# EAGLE schematic mosfet_out_cypress (EAGLE 7.2.0)
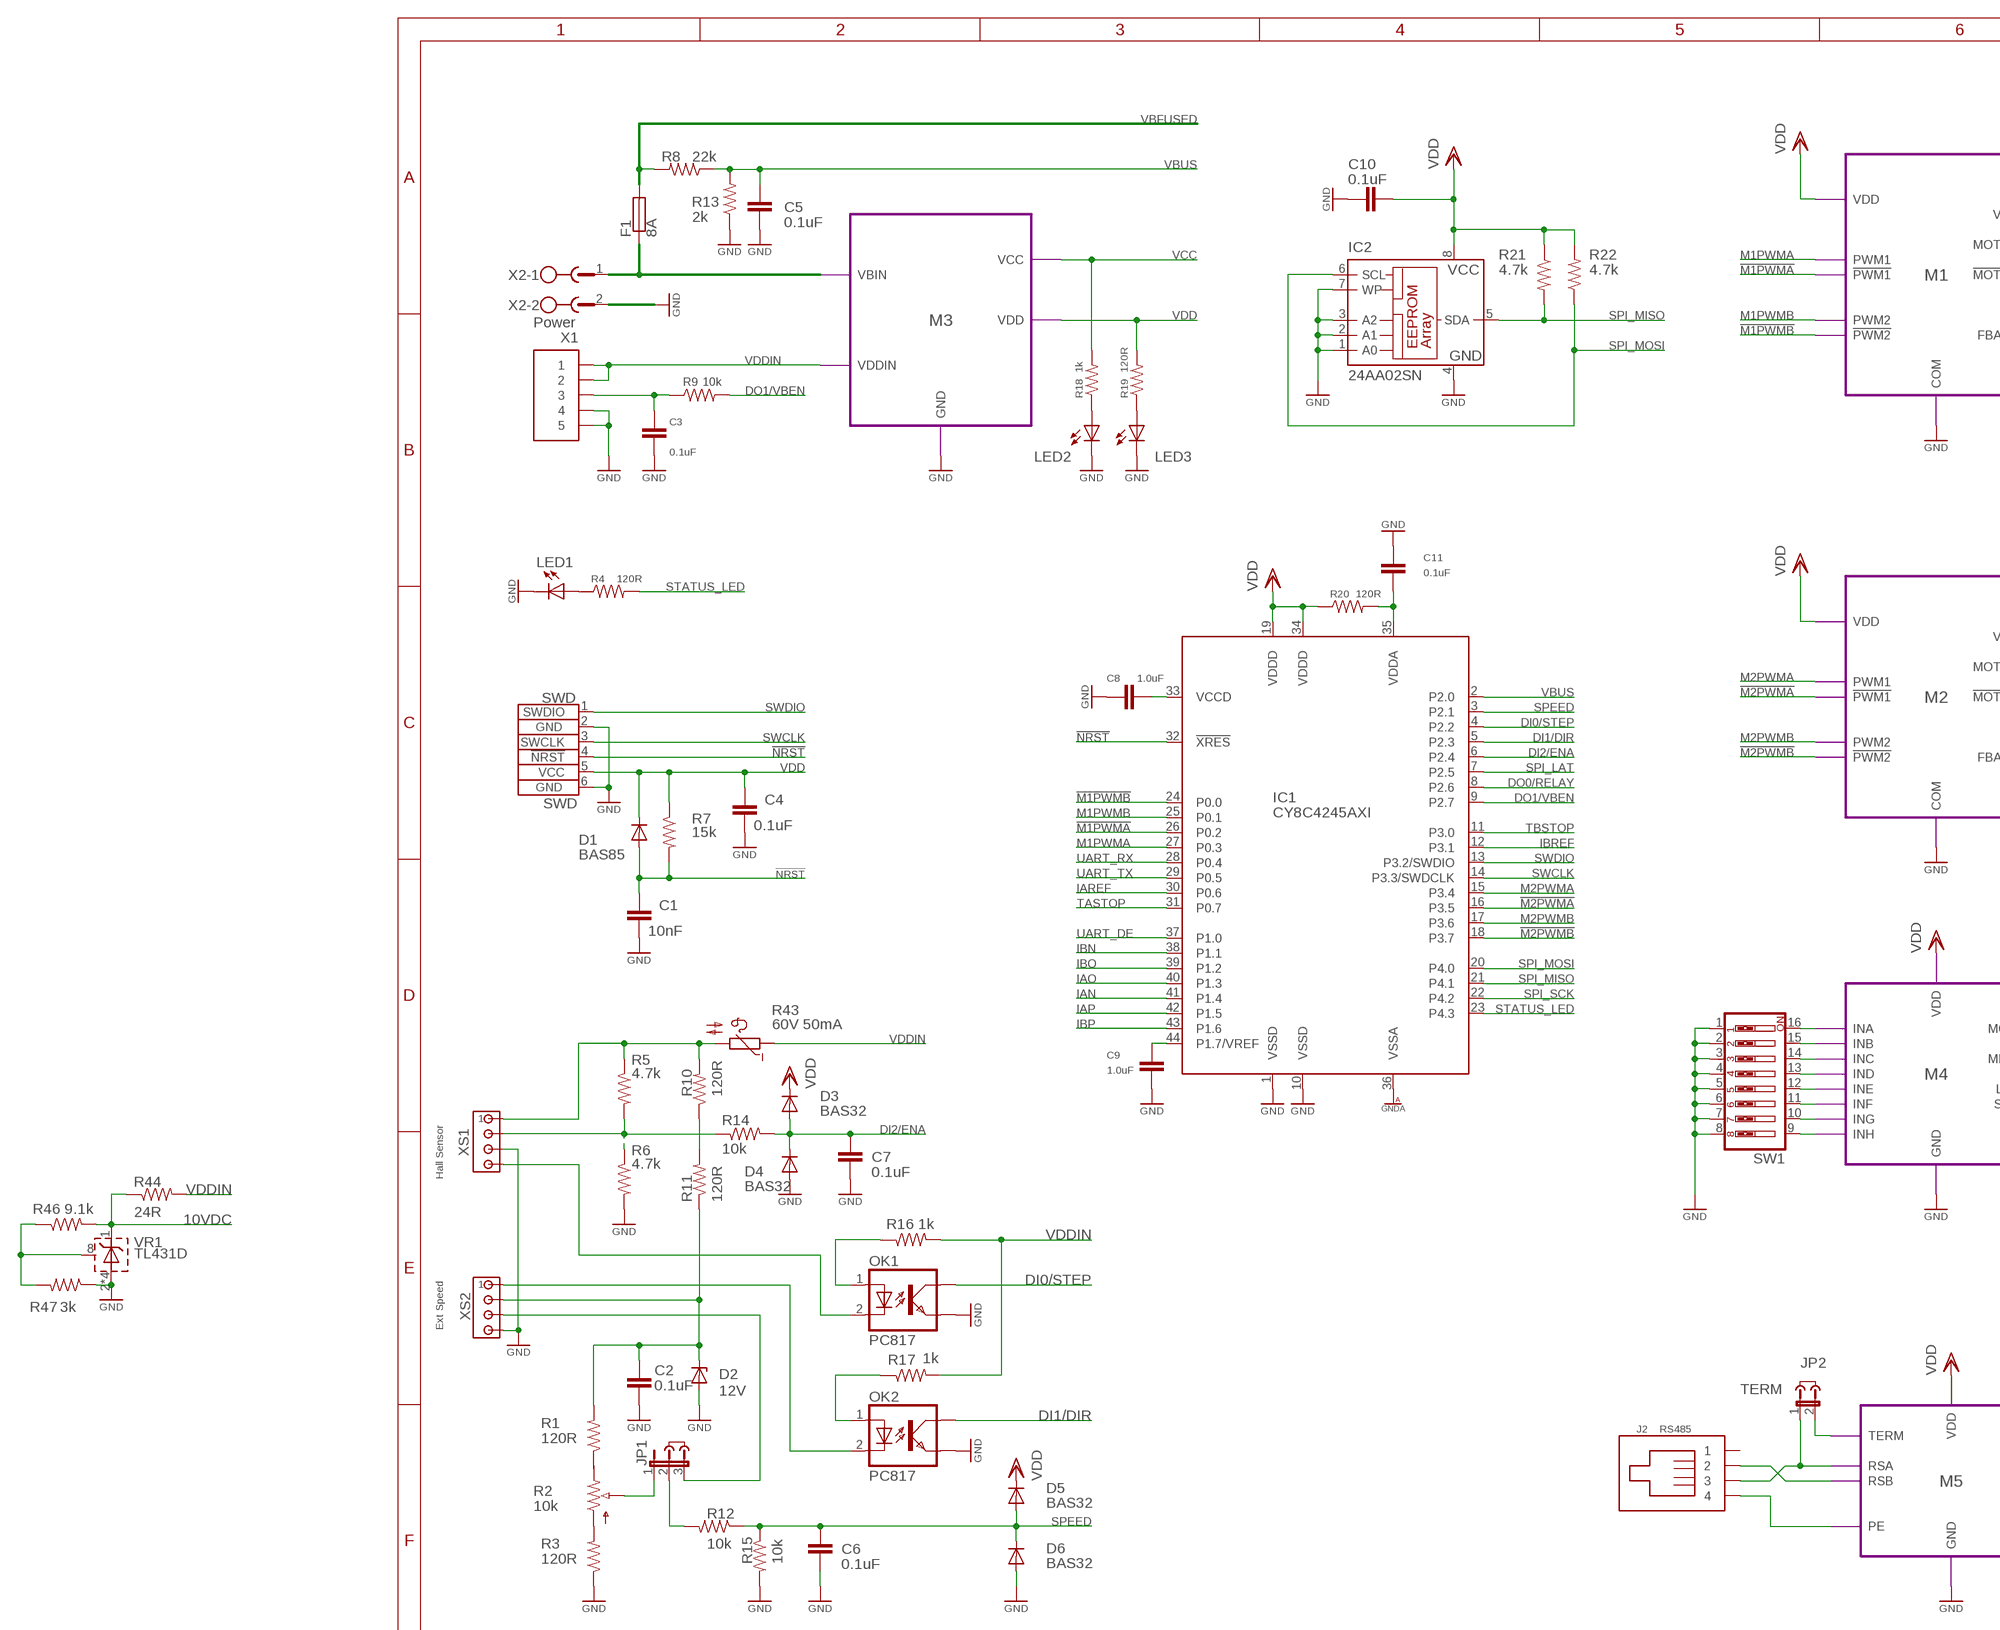
[diagram p0: schematic, sheet 1, part 1 of 2]
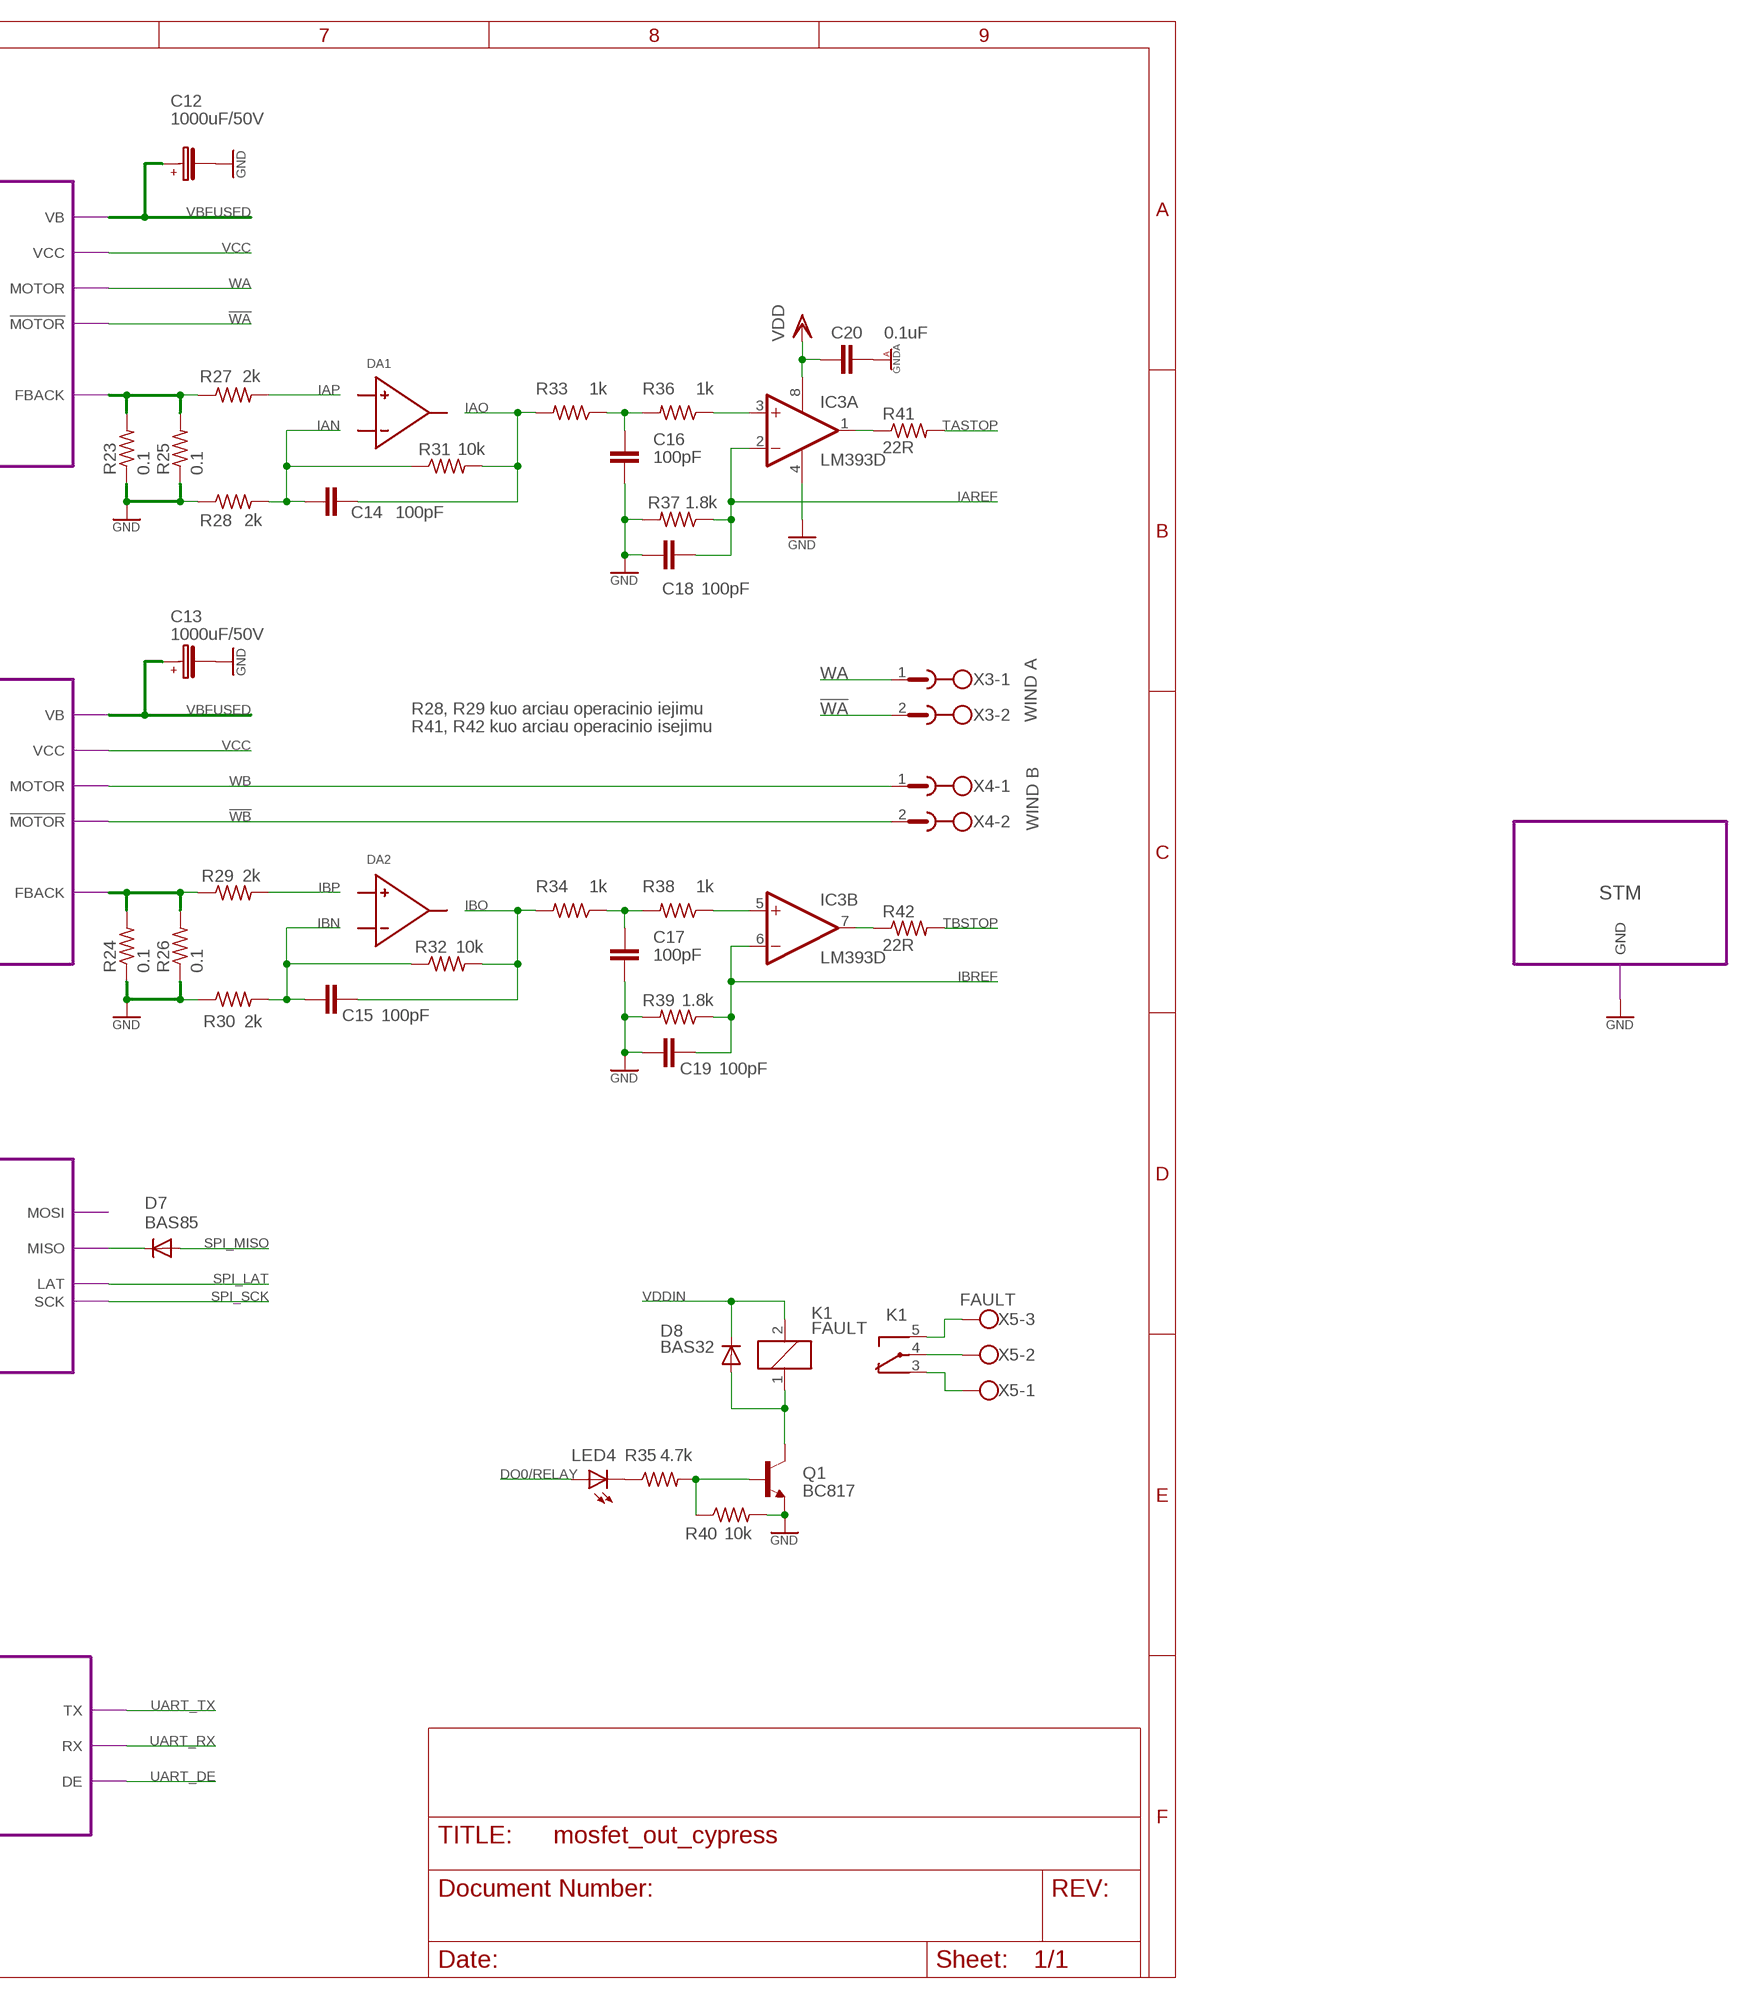
[diagram p1: schematic, sheet 1, part 2 of 2]

## Parts
C1  10nF  C0805-10NF  [C0805]
C2  0.1uF  C0805-0.1UF  [C0805]
C3  0.1uF  C0805-0.1UF  [C0805]
C4  0.1uF  C0805-0.1UF  [C0805]
C5  0.1uF  C0805-0.1UF  [C0805]
C6  0.1uF  C0805-0.1UF  [C0805]
C7  0.1uF  C0805-0.1UF  [C0805]
C8  1.0uF  C1206-1UF  [C1206]
C9  1.0uF  C1206-1UF  [C1206]
C10  0.1uF  C0805-0.1UF  [C0805]
C11  0.1uF  C0805-0.1UF  [C0805]
C12  1000uF/50V  CPOL/5X13-1000UF/50V  [E5-13]
C13  1000uF/50V  CPOL/5X13-1000UF/50V  [E5-13]
C14  100pF  C0805-100PF  [C0805]
C15  100pF  C0805-100PF  [C0805]
C16  100pF  C0805-100PF  [C0805]
C17  100pF  C0805-100PF  [C0805]
C18  100pF  C0805-100PF  [C0805]
C19  100pF  C0805-100PF  [C0805]
C20  0.1uF  C0805-0.1UF  [C0805]
D1  BAS85  DIODE-MINIMELF  [MINIMELF]
D2  12V  ZD-BZV55-B12V/MINIMELF  [MINIMELF]
D3  BAS32  DIODE-MINIMELF  [MINIMELF]
D4  BAS32  DIODE-MINIMELF  [MINIMELF]
D5  BAS32  DIODE-MINIMELF  [MINIMELF]
D6  BAS32  DIODE-MINIMELF  [MINIMELF]
D7  BAS85  DIODE-MINIMELF  [MINIMELF]
D8  BAS32  DIODE-MINIMELF  [MINIMELF]
F1  8A  SH22  [SH22]
IC1  CY8C4245AXI  [PQFP44]
IC2  24AA02SN  [SO-08]
IC3  LM393D  [SO08]
J1  JUMPER  [JUMP]
J2  RS485  RJ11S  [RJ11_SMD]
J3  JUMPER  [JUMP]
JP1  JUMPER-3PTH  [1X03]
JP2  TERM  JUMPER-2PTH  [1X02]
K1  FAULT  FTR-LYC5  [FTR-LYC]
LED1  EL19-21SYGC  LED-EL19-21SYGC-0805  [CHIPLED_0805]
LED2  EL19-21SYGC  LED-EL19-21SYGC-0805  [CHIPLED_0805]
LED3  EL19-21SYGC  LED-EL19-21SYGC-0805  [CHIPLED_0805]
LED4  EL19-21SYGC  LED-EL19-21SYGC-0805  [CHIPLED_0805]
OK1  PC817  [DIL04]
OK2  PC817  [DIL04]
Q1  BC817  NPN-BC817/SOT23  [SOT23-BEC]
R1  120R  R0805-120R-1%  [R0805]
R2  10k  TRIM_US-CA6V  [CA6V]
R3  120R  R0805-120R-1%  [R0805]
R4  120R  R0805-120R-1%  [R0805]
R5  4.7k  R0805-4.7K-1%  [R0805]
R6  4.7k  R0805-4.7K-1%  [R0805]
R7  15k  R0805-15K-1%  [R0805]
R8  22k  R-US_R1206  [R1206]
R9  10k  R-US_R0805  [R0805]
R10  120R  R1206-120R-1%  [R1206]
R11  120R  R1206-120R-1%  [R1206]
R12  10k  R0805-10K-1%  [R0805]
R13  2k  R0805-2K-1%  [R0805]
R14  10k  R0805-10K-1%  [R0805]
R15  10k  R0805-10K-1%  [R0805]
R16  1k  R0805-1K-1%  [R0805]
R17  1k  R0805-1K-1%  [R0805]
R18  1k  R0805-1K-1%  [R0805]
R19  120R  R0805-120R-1%  [R0805]
R20  120R  R0805-120R-1%  [R0805]
R21  4.7k  R0805-4.7K-1%  [R0805]
R22  4.7k  R0805-4.7K-1%  [R0805]
R23  0.1  R-US_0411/15  [0411/15]
R24  0.1  R-US_0411/15  [0411/15]
R25  0.1  R-US_0411/15  [0411/15]
R26  0.1  R-US_0411/15  [0411/15]
R27  2k  R0805-2K-1%  [R0805]
R28  2k  R0805-2K-1%  [R0805]
R29  2k  R0805-2K-1%  [R0805]
R30  2k  R0805-2K-1%  [R0805]
R31  10k  R0805-10K-1%  [R0805]
R32  10k  R0805-10K-1%  [R0805]
R33  1k  R0805-1K-1%  [R0805]
R34  1k  R0805-1K-1%  [R0805]
R35  4.7k  R0805-4.7K-1%  [R0805]
R36  1k  R0805-1K-1%  [R0805]
R37  1.8k  R-US_R0805  [R0805]
R38  1k  R0805-1K-1%  [R0805]
R39  1.8k  R-US_R0805  [R0805]
R40  10k  R0805-10K-1%  [R0805]
R41  22R  R0805-22R-1%  [R0805]
R42  22R  R0805-22R-1%  [R0805]
R43  60V 50mA  POLYSW-RXE005/B57164  [B57164]
R44  24R  R0.6W-24R  [0207/7]
R46  9.1k  R0805-9.1K  [R0805]
R47  3k  R0805-3K  [R0805]
SW1  SW_DIP-8  [DIPSWITCH-08]
SWD  SWD  [ISP]
VR1  TL431D  [SO-08]
X1  5PIN_NS25-W5P  [6410-05]
X2  Power  MSTBV2  [MSTBV2]
X3  WIND A  MSTBV2  [MSTBV2]
X4  WIND B  MSTBV2  [MSTBV2]
X5  FAULT  W237-103  [W237-103]
XS1  CONN4K  [ZALIA_4K]
XS2  CONN4K  [ZALIA_4K]

## Module instances
M1 = M1
M2 = M1
M3 = M3
M4 = M4
M5 = M5
STM = STM

## Nets
10VDC: C2.1 D2.C R1.2 R11.1 R44.1 R46.2 VR1.1(C) XS2.2
!M1PWMA: IC1.26(P0.2) ; port M1.!PWM1
!M1PWMB: IC1.24(P0.0) ; port M1.!PWM2
!M2PWMA: IC1.16(P3.5) ; port M2.!PWM1
!M2PWMB: IC1.18(P3.7) ; port M2.!PWM2
!NRST: C1.1 D1.A IC1.32(!XRES!) R7.2 SWD.4(!NRST)
!WA [power+]: X3.2 ; port M1.!MOTOR
!WB [power+]: X4.2 ; port M2.!MOTOR
DI0: OK1.2(C) XS1.4
DI0/STEP: IC1.4(P2.2) OK1.4(COL)
DI1: OK2.2(C) XS2.1
DI1/DIR: IC1.5(P2.3) OK2.4(COL)
DI2/ENA: C7.1 D3.A D4.C IC1.6(P2.4) R14.2
DO0/RELAY: IC1.8(P2.6) LED4.A
DO1/VBEN: IC1.9(P2.7) R9.2
GND: C1.2 C2.2 C3.2 C4.2 C5.2 C6.2 C7.2 C8.1 C9.1 C10.2 C11.1 C12.- C13.- C16.2 C17.2 C18.2 C19.2 D2.A D4.A D6.A IC1.1(VSSD) IC1.10(VSSD) IC2.1(A0) IC2.2(A1) IC2.3(A2) IC2.4(GND) IC2.7(WP) IC3.4(P:V-) LED1.C LED2.C LED3.C OK1.3(EMIT) OK2.3(EMIT) Q1.E R3.1 R6.2 R13.1 R15.2 R23.1 R24.1 R25.1 R26.1 R28.1 R30.1 R37.2 R39.2 R40.2 R47.1 SW1.1 SW1.2 SW1.3 SW1.4 SW1.5 SW1.6 SW1.7 SW1.8 SWD.2(GND) SWD.6(GND) VR1.2(A) VR1.3(A) VR1.6(A) VR1.7(A) X1.4 X1.5 X2.2 XS1.3 XS2.4 ; port M1.COM M2.COM M3.GND M4.GND M5.GND STM.GND
GNDA: C20.2 IC1.36(VSSA)
IA [power+]: R23.2 R25.2 R27.1 ; port M1.FBACK
IAN: C14.2 IC1.41(P1.4) R28.2 R31.1
IAO: C14.1 IC1.40(P1.3) R31.2 R33.2
IAP: IC1.42(P1.5) R27.2
IAREF: C18.1 IC1.30(P0.6) IC3.2(A:-IN) R37.1
IB [power+]: R24.2 R26.2 R29.1 ; port M2.FBACK
IBN: C15.2 IC1.38(P1.1) R30.2 R32.1
IBO: C15.1 IC1.39(P1.2) R32.2 R34.2
IBP: IC1.43(P1.6) R29.2
IBREF: C19.1 IC1.12(P3.1) IC3.6(B:-IN) R39.1
M1PWMA: IC1.27(P0.3) ; port M1.PWM1
M1PWMB: IC1.25(P0.1) ; port M1.PWM2
M2PWMA: IC1.15(P3.4) ; port M2.PWM1
M2PWMB: IC1.17(P3.6) ; port M2.PWM2
N$1: IC3.7(B:OUT) R42.1
N$2: D7.C ; port M4.MISO
N$3: IC3.1(A:OUT) R41.1
N$4: C11.2 IC1.35(VDDA) R20.2
N$5: IC3.3(A:+IN) R36.1
N$6: IC3.5(B:+IN) R38.1
N$7: JP1.1 R2.S
N$8: R2.A R3.2
N$9: JP1.2 R12.2
N$10: JP1.3 XS2.3
N$11: R10.1 R11.2
N$12: JP2.2 ; port M5.TERM
N$13: SW1.9 ; port M4.INH
N$14: R1.1 R2.E
N$15: SW1.10 ; port M4.ING
N$16: SW1.11 ; port M4.INF
N$17: C16.1 R33.1 R36.2
N$18: C17.1 R34.1 R38.2
N$19: SW1.12 ; port M4.INE
N$20: SW1.13 ; port M4.IND
N$21: SW1.14 ; port M4.INC
N$22: SW1.15 ; port M4.INB
N$23: SW1.16 ; port M4.INA
N$24: Q1.B R35.2 R40.1
N$25 [power]: D8.A K1.1 Q1.C
N$26 [power+]: K1.4(-1:P) X5.2
N$27 [power+]: K1.5(-1:S) X5.3
N$28 [power+]: K1.3(-1:O) X5.1
N$29 [power]: J2.2 ; port M5.RSB
N$30 [power]: J2.3 JP2.1 ; port M5.RSA
N$31 [power+]: J2.4 ; port M5.PE
N$32: R5.2 R6.1 R14.1 XS1.2
N$33: LED1.A R4.1
N$34: LED2.A R18.1
N$35: LED3.A R19.1
N$37: LED4.C R35.1
N$38: OK1.1(A) R16.1
N$39: R5.1 R10.2 R43.2 XS1.1
N$42: OK2.1(A) R17.1
N$43: R46.1 R47.2 VR1.8(R)
N$47: C9.2 IC1.44(P1.7/VREF)
N$48: C8.2 IC1.33(VCCD)
SPEED: C6.1 D5.A D6.C IC1.3(P2.1) R12.1 R15.1
SPI_LAT: IC1.7(P2.5) ; port M4.LAT
SPI_MISO: D7.A IC1.21(P4.1) IC2.5(SDA) R21.2
SPI_MOSI: IC1.20(P4.0) IC2.6(SCL) R22.1
SPI_SCK: IC1.22(P4.2) ; port M4.SCK
STATUS_LED: IC1.23(P4.3) R4.2
SWCLK: IC1.14(P3.3/SWDCLK) SWD.3(SWCLK)
SWDIO: IC1.13(P3.2/SWDIO) SWD.1(SWDIO)
TASTOP: IC1.31(P0.7) R41.2
TBSTOP: IC1.11(P3.0) R42.2
UART_DE: IC1.37(P1.0) ; port M5.DE
UART_RX: IC1.28(P0.4) ; port M5.RX
UART_TX: IC1.29(P0.5) ; port M5.TX
VBENOUT: C3.1 R9.1 X1.3
VBFUSED [power+]: C12.+ C13.+ F1.2 R8.2 ; port M1.VB M2.VB
VBIN [power+]: F1.1 X2.1 ; port M3.VBIN
VBUS: C5.1 IC1.2(P2.0) R8.1 R13.2
VCC [power]: R18.2 ; port M1.VCC M2.VCC M3.VCC
VDD: C4.1 C10.1 C20.1 D1.C D3.C D5.C IC1.19(VDDD) IC1.34(VDDD) IC2.8(VCC) IC3.8(P:V+) R7.1 R19.2 R20.1 R21.1 R22.2 SWD.5(VCC) ; port M2.VDD M1.VDD M3.VDD M4.VDD M5.VDD
VDDIN [power]: D8.C K1.2 R16.2 R17.2 R43.1 R44.2 X1.1 X1.2 ; port M3.VDDIN
WA [power+]: X3.1 ; port M1.MOTOR
WB [power+]: X4.1 ; port M2.MOTOR
Unconnected: J2.1

## Notes on the sheet
- R28, R29 kuo arciau operacinio iejimu
- R41, R42 kuo arciau operacinio isejimu
- Hall Sensor
- Ext Speed

## Library data of the parts
C1 = discr_lib:C?: Kondensatorius; PACK_TYPE: SMD; TYPE: X7R; U: 50V; VENT_CODE: ZKN080
C2-C7 C10 C11 C20 = discr_lib:C?: Kondensatorius; PACK_TYPE: SMD; TYPE: X7R; VENT_CODE: ZKN065
C8 C9 = discr_lib:C?: Kondensatorius; PACK_TYPE: SMD; TYPE: X7R; U: 16V; VENT_CODE: ZKN062
C12 C13 = discr_lib:CPOL?: Kondensatorius elektrolitinis; PACK_TYPE: DIP; VENT_CODE: ZKN056
C14-C19 = discr_lib:C?: Kondensatorius; PACK_TYPE: SMD; U: 50V; VENT_CODE: ---
D1 D3-D8 = diode:DIODE-: DIODE
D2 = discr_lib:ZD*: Stabilitronas; PACK_TYPE: SMD; VENT_CODE: ZELM055
F1 = fuse:SH22: FUSE HOLDER CS PFP30, Schukat
IC1 = cypress:CY8C42*
IC2 = microchip:24*: Serial EEPROM I2C
IC3 = linear:LM393: Komparatorius; PACK_TYPE: SMD; VENT_CODE: ---
J1 J3 = jumper:JUMPER: JUMPER header
J2 = connectors:RJ11*
JP1 = SparkFun:JUMPER-3
JP2 = SparkFun:JUMPER-2: Jumper Basic 0.1" spaced jumper. Use with breakaway headers.
K1 = relay:FTR-LYC: Schmales Netzrelais NETZRELAIS FTR-LYCA024V 1XUM 6A/250VAC Distributor: Conrad electronic Bestell Nr.: 504382 - 62 Source: http://www2.produktinfo.conrad.com/datenblaetter/500000-524999/504382-da-01-de-NETZRELAIS_FTR-LYCA024V_1XUM_6A_250VAC.pdf
LED1-LED4 = discr_lib:LED*: Sviesos diodas; PACK_TYPE: SMD; PARAMS: Green; VENT_CODE: ZELD010
OK1 OK2 = optocoupler:PC817: SHARP OPTO COUPLER
Q1 = discr_lib:NPN*: NPN Tranzistorius; PACK_TYPE: SMD; PARAMS: 45V 0.5A; VENT_CODE: ZELT008
R1 R3 R4 R19 R20 = discr_lib:R?: Rezistorius; DIFF: 1%; PACK_TYPE: SMD; VENT_CODE: ZELRS055
R2 = pot:TRIM_US-: POTENTIOMETER
R5 R6 R21 R22 R35 = discr_lib:R?: Rezistorius; DIFF: 1%; PACK_TYPE: SMD; VENT_CODE: ZELRS053
R7 = discr_lib:R?: Rezistorius; DIFF: 1%; PACK_TYPE: SMD; VENT_CODE: ZELRS052
R8 = rcl:R-US_: Rezistorius; PACK_TYPE: SMD; VENT_CODE: ---
R9 R37 R39 = rcl:R-US_: Rezistorius; PACK_TYPE: SMD
R10 R11 = discr_lib:R?: Rezistorius; DIFF: 1%; PACK_TYPE: SMD; VENT_CODE: ZELRS042
R12 R14 R15 R31 R32 R40-R42 = discr_lib:R?: Rezistorius; DIFF: 1%; PACK_TYPE: SMD; VENT_CODE: ---
R13 R27-R30 = discr_lib:R?: Rezistorius; DIFF: 1%; PACK_TYPE: SMD; VENT_CODE: ZELRS063
R16-R18 R33 R34 R36 R38 = discr_lib:R?: Rezistorius; DIFF: 1%; PACK_TYPE: SMD; VENT_CODE: ZELRS061
R23-R26 = rcl:R-US_: Rezistorius
R43 = discr_lib:POLYSW*: Atsistatamtis saugiklis; PACK_TYPE: DIP; VENT_CODE: ZEL094
R44 = discr_lib:R?: Rezistorius; PACK_TYPE: DIP; POWER: 0.6W
R46 = discr_lib:R?: Rezistorius; DIFF: 1%; PACK_TYPE: SMD
R47 = discr_lib:R?: Rezistorius; PACK_TYPE: SMD
SW1 = SparkFun:SW_DIP-8: DIP Switch 8 Position Spark Fun Electronics SKU : COM-08034
SWD = connectors:SWD: Jungtis; PACK_TYPE: DIP; VENT_CODE: ---
VR1 = vstab_lib:TL431*: VOLTAGE REGULATOR; PACK_TYPE: SMD
X1 = connectors:5PIN_
X2-X4 = con-phoenix-508:MSTBV2: PHOENIX
X5 = con-wago-500:W237-103: WAGO SCREW CLAMP
XS1 XS2 = conn_lib:CONN4K: AMP connector

## Module M1
Ports: PWM1(in) !PWM1(in) MOTOR(out) !MOTOR(out) PWM2(in) !PWM2(in) FBACK(out) VB(pwr) VDD(pwr) VCC(pwr) COM(pwr)
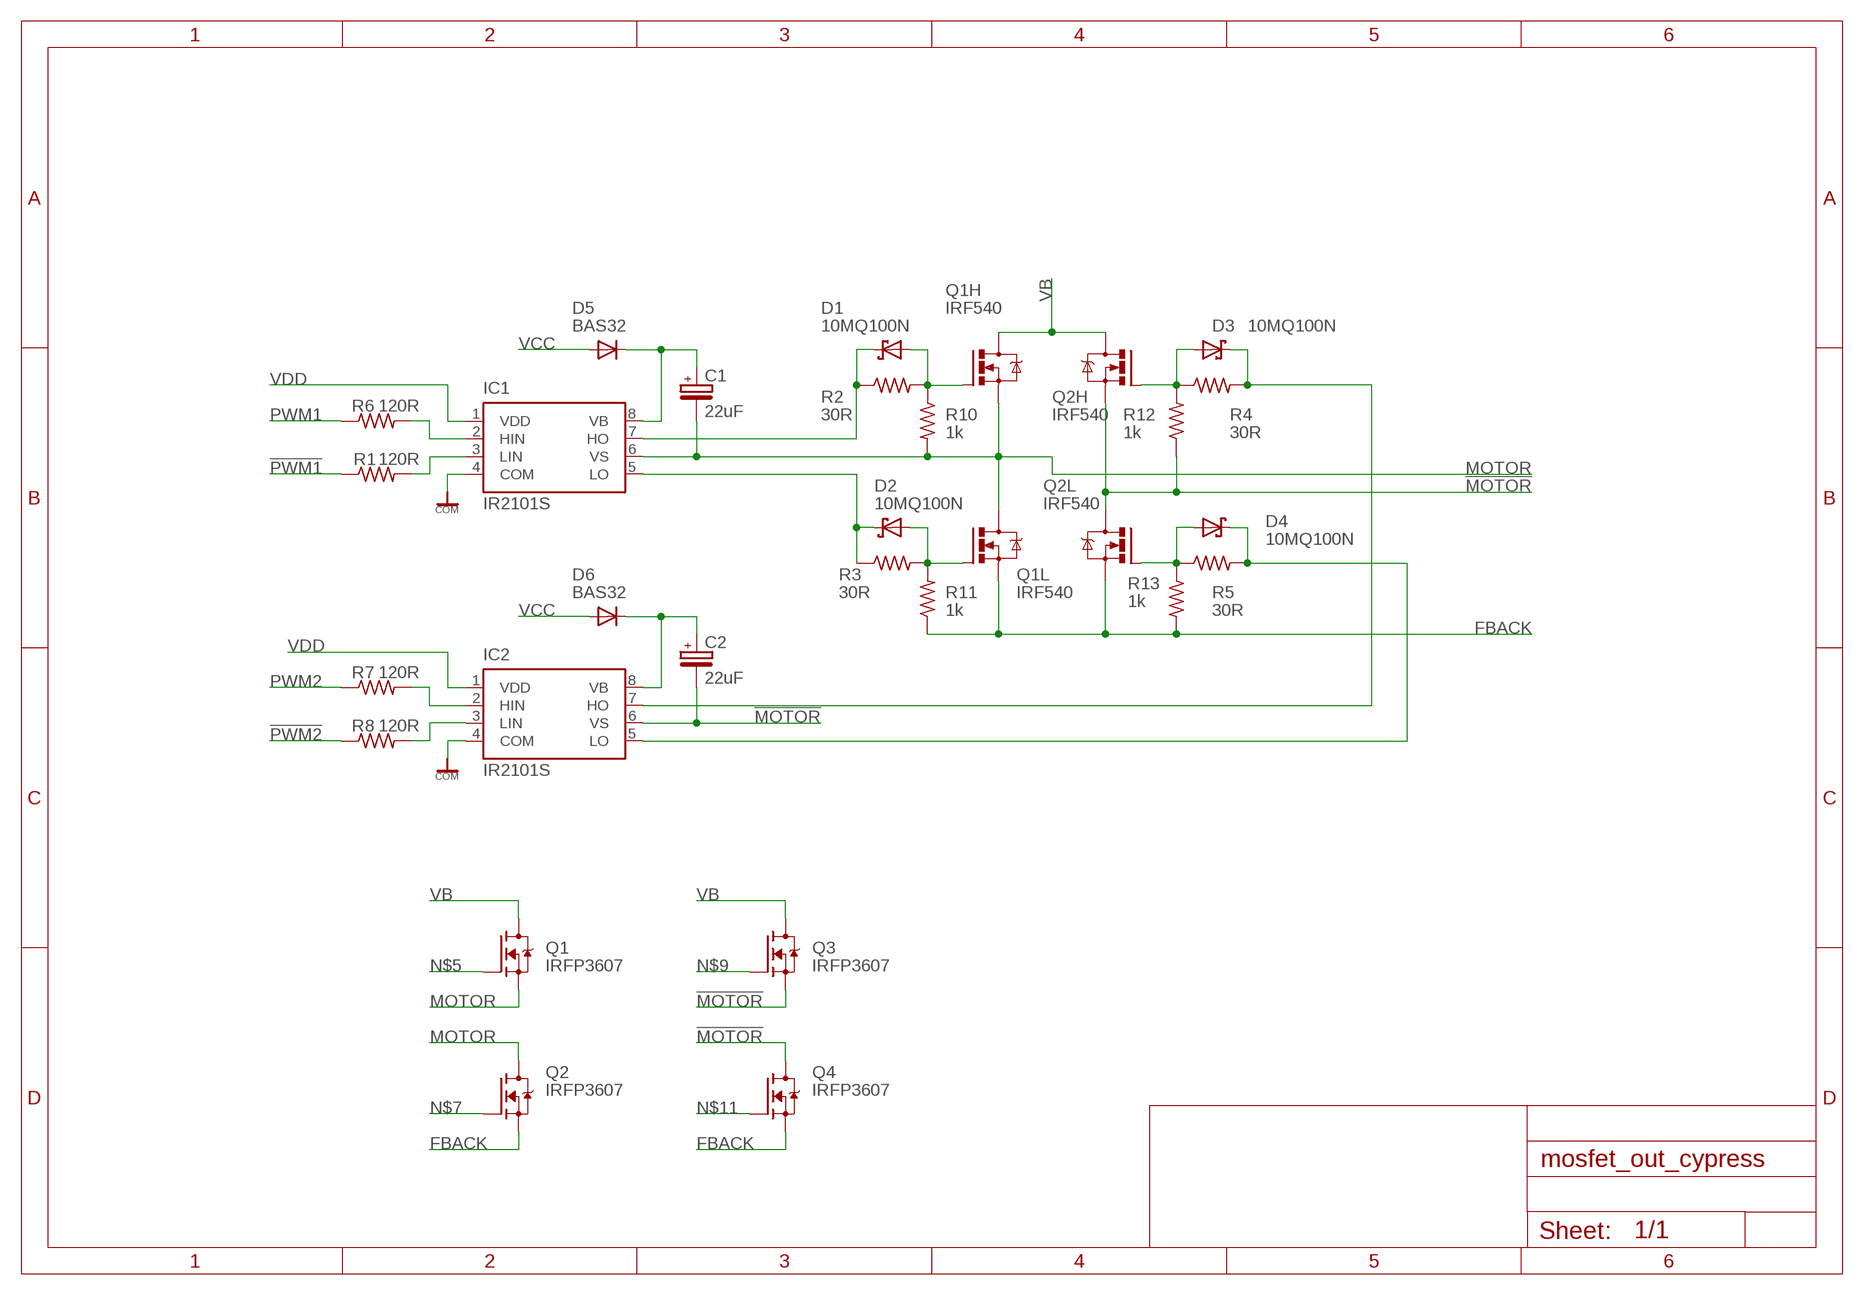
[diagram p2: schematic, module M1, sheet 1]

### Parts
C1  22uF  CPOL-EUSMCC  [SMC_C]
C2  22uF  CPOL-EUSMCC  [SMC_C]
D1  10MQ100N  DSH-10MQ100/DO214AC  [DO214AC]
D2  10MQ100N  DSH-10MQ100/DO214AC  [DO214AC]
D3  10MQ100N  DSH-10MQ100/DO214AC  [DO214AC]
D4  10MQ100N  DSH-10MQ100/DO214AC  [DO214AC]
D5  BAS32  DSW-BAS32/MINIMELF  [MINIMELF]
D6  BAS32  DSW-BAS32/MINIMELF  [MINIMELF]
IC1  IR2101S  [SO08]
IC2  IR2101S  [SO08]
Q1  IRFP3607  IRFP3607-H1  [D-PAK_TO252AA]
Q1H  IRF540  [TO220BH_NO_HOLE]
Q1L  IRF540  [TO220BH_NO_HOLE]
Q2  IRFP3607  IRFP3607-H1  [D-PAK_TO252AA]
Q2H  IRF540  [TO220BH_NO_HOLE]
Q2L  IRF540  [TO220BH_NO_HOLE]
Q3  IRFP3607  IRFP3607-H1  [D-PAK_TO252AA]
Q4  IRFP3607  IRFP3607-H1  [D-PAK_TO252AA]
R1  120R  R0805-100R-1%  [R0805]
R2  30R  R0805-22R-1%  [R0805]
R3  30R  R0805-22R-1%  [R0805]
R4  30R  R0805-22R-1%  [R0805]
R5  30R  R0805-22R-1%  [R0805]
R6  120R  R0805-100R-1%  [R0805]
R7  120R  R0805-100R-1%  [R0805]
R8  120R  R0805-100R-1%  [R0805]
R10  1k  R0805-22R-1%  [R0805]
R11  1k  R0805-22R-1%  [R0805]
R12  1k  R0805-22R-1%  [R0805]
R13  1k  R0805-22R-1%  [R0805]

### Nets
!MOTOR [power]: C2.- IC2.6(VS) Q2H.S Q2L.D Q3.3(S) Q4.4(D) R12.1
!PWM1: R1.1
!PWM2: R8.1
AH [power]: D1.C IC1.7(HO) R2.1
AL: D2.C IC1.5(LO) R3.1
BH [power]: D3.C IC2.7(HO) R4.2
BL: D4.C IC2.5(LO) R5.2
COM: IC1.4(COM) IC2.4(COM)
FBACK: Q1L.S Q2.3(S) Q2L.S Q4.3(S) R11.1 R13.2
MOTOR [power]: C1.- IC1.6(VS) Q1.3(S) Q1H.S Q1L.D Q2.4(D) R10.2
N$1 [power]: C2.+ D6.C IC2.8(VB)
N$2 [power]: C1.+ D5.C IC1.8(VB)
N$3: IC1.3(LIN) R1.2
N$4: IC1.2(HIN) R6.2
N$5: D1.A Q1.1(G) Q1H.G R2.2 R10.1
N$6: IC2.2(HIN) R7.2
N$7: D2.A Q1L.G Q2.1(G) R3.2 R11.2
N$8: IC2.3(LIN) R8.2
N$9: D3.A Q2H.G Q3.1(G) R4.1 R12.2
N$11: D4.A Q2L.G Q4.1(G) R5.1 R13.1
PWM1: R6.1
PWM2: R7.1
VB: Q1.4(D) Q1H.D Q2H.D Q3.4(D)
VCC: D5.A D6.A
VDD: IC1.1(VDD) IC2.1(VDD)

### Library data of the parts
C1 C2 = rcl:CPOL-EU: POLARIZED CAPACITOR, European symbol
D1-D4 = discr_lib:DSH*: Shottky diodas; PACK_TYPE: SMD; PARAMS: 100V 2.1A; VENT_CODE: ZELD046
D5 D6 = discr_lib:DSW*: Diodas; PACK_TYPE: SMD; PARAMS: 75V 200mA 4ns; TYPE: Switch; VENT_CODE: ZELD003
IC1 IC2 = ir:IR2101
Q1-Q4 = transistor-fet:IRF*3607: MOSFET tranzistorius; PACK_TYPE: SMD; PARAM: 75V 56A 9.0 mOhm
Q1H Q1L Q2H Q2L = transistor-power:IRF540: HEXFET Power MOSFET
R1 R6-R8 = discr_lib:R?: Rezistorius; DIFF: 1%; PACK_TYPE: SMD; VALUE: 100R; VENT_CODE: ZELRS005
R2-R5 R10-R13 = discr_lib:R?: Rezistorius; DIFF: 1%; PACK_TYPE: SMD; VALUE: 22R; VENT_CODE: ---

## Module M3
Ports: VBIN(pwr) VCC(out) VDD(out) VDDIN(pwr) GND(pwr)
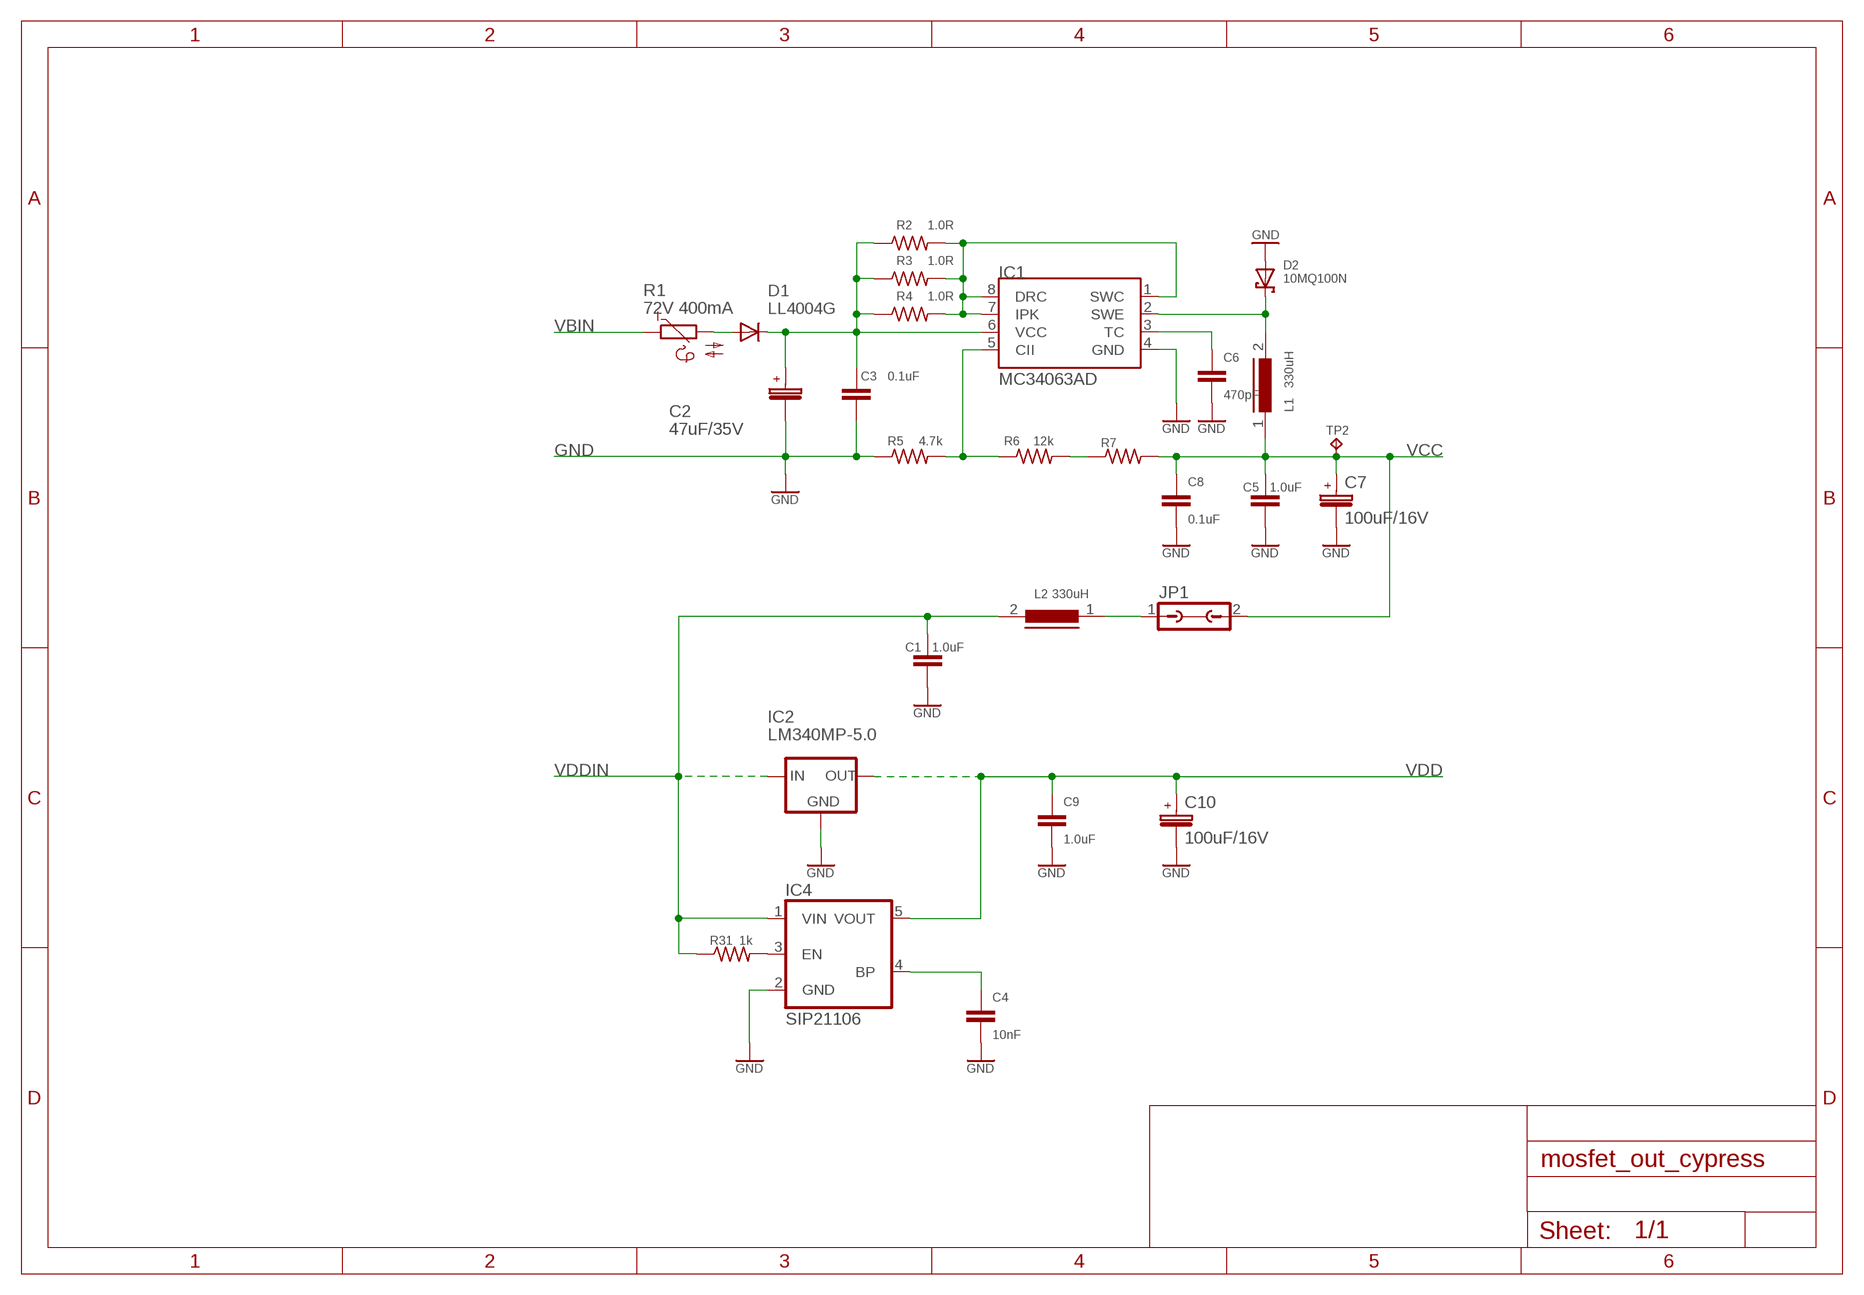
[diagram p3: schematic, module M3, sheet 1]

### Parts
C1  1.0uF  C1206-1UF  [C1206]
C2  47uF/35V  CPOL/2.5X6-47UF/35V  [E2,5-6]
C3  0.1uF  C0805-0.1UF  [C0805]
C4  10nF  C0805-10NF  [C0805]
C5  1.0uF  C1206-1UF  [C1206]
C6  470pF  C0805-470PF  [C0805]
C7  100uF/16V  CPOL/2.5X6-100UF/16V  [E2,5-6]
C8  0.1uF  C0805-0.1UF  [C0805]
C9  1.0uF  C1206-1UF  [C1206]
C10  100uF/16V  CPOL/2.5X6-100UF/16V  [E2,5-6]
D1  LL4004G  DSW-LL4004/MELF  [MELF-MLL41]
D2  10MQ100N  DSH-10MQ100/DO214AC  [DO214AC]
IC1  MC34063AD  [SO08]
IC2  LM340MP-5.0  LM340  [SOT223]
IC4  SIP21106  SIP21106DT  [SOT25]
J1  VB power  JUMP-Q  [JUMP]
JP1  JP1Q  [JP1]
L1  330uH  LSDR7045-330UH  [DR7045]
L2  330uH  LSDR7045-330UH  [DR7045]
R1  72V 400mA  POLYSW-RXE040/B57164  [B57164]
R2  1.0R  R1206-1.0R-1%  [R1206]
R3  1.0R  R1206-1.0R-1%  [R1206]
R4  1.0R  R1206-1.0R-1%  [R1206]
R5  4.7k  R0805-4.7K-1%  [R0805]
R6  12k  R0805-12K-1%  [R0805]
R7  xxx  R-US_R0805  [R0805]
R31  1k  R0805-1K-1%  [R0805]
TP2  TPB1,27  [B1,27]

### Nets
GND: C1.2 C2.- C3.2 C4.2 C5.2 C6.2 C7.- C8.2 C9.2 C10.- D2.A IC1.4(GND) IC2.2(GND) IC2.4(GND) IC4.2(GND) R5.1
N$1 [power]: JP1.1 L2.1
N$2: C4.1 IC4.4(BP)
N$3 [power]: IC1.1(SWC) IC1.7(IPK) IC1.8(DRC) R2.2 R3.2 R4.2
N$4: IC1.5(CII) R5.2 R6.1
N$5: C6.1 IC1.3(TC)
N$6: R6.2 R7.1
N$7 [power]: C2.+ C3.1 D1.C IC1.6(VCC) R2.1 R3.1 R4.1
N$8 [power]: D2.C IC1.2(SWE) L1.2
N$9: IC4.3(EN) R31.2
N$16 [power]: D1.A R1.2
VBIN [power+]: R1.1
VCC: C5.1 C7.+ C8.1 JP1.2 L1.1 R7.2 TP2.PP(TP)
VDD [power]: C9.1 C10.+ IC2.3(OUT) IC4.5(VOUT)
VDDIN [power]: C1.1 IC2.1(IN) IC4.1(VIN) L2.2 R31.1

### Library data of the parts
C1 C5 C9 = discr_lib:C?: Kondensatorius; PACK_TYPE: SMD; TYPE: X7R; U: 16V; VENT_CODE: ZKN062
C2 = discr_lib:CPOL?: Kondensatorius elektrolitinis; PACK_TYPE: DIP; VENT_CODE: ---
C3 C8 = discr_lib:C?: Kondensatorius; PACK_TYPE: SMD; TYPE: X7R; VENT_CODE: ZKN065
C4 = discr_lib:C?: Kondensatorius; PACK_TYPE: SMD; TYPE: X7R; U: 50V; VENT_CODE: ZKN080
C6 = discr_lib:C?: Kondensatorius; PACK_TYPE: SMD; TYPE: X7R; U: 50V; VENT_CODE: ZKN087
C7 C10 = discr_lib:CPOL?: Kondensatorius elektrolitinis; PACK_TYPE: DIP; VENT_CODE: ZKN008
D1 = discr_lib:DSW*: Diodas; PACK_TYPE: SMD; PARAMS: 400V 1A; TYPE: Switch; VENT_CODE: ZELD019
D2 = discr_lib:DSH*: Shottky diodas; PACK_TYPE: SMD; PARAMS: 100V 2.1A; VENT_CODE: ZELD046
IC1 = linear_lib:MC34063: Step Up/Down impulsinio maitinimo saltinio draiveris; PACK_TYPE: SMD; VENT_CODE: ZELM041
IC2 = v-reg:LM340: Stabilizatorius; PACK_TYPE: SMD; VENT_CODE: ZELM013
IC4 = v-reg:SIP2110*?: Stabilizatorius; MARK: N3; PACK_TYPE: SMD; VALUE: SIP21106-DT-33-E3; VENT_CODE: ZELM092
J1 = jumper:JUMP-Q: JUMPER header
JP1 = jumper:JP1Q: JUMPER
L1 L2 = discr_lib:L?: Droselis; PACK_TYPE: SMD; VENT_CODE: ZELI009
R1 = discr_lib:POLYSW*: Atsistatamtis saugiklis; PACK_TYPE: DIP; VENT_CODE: ZEL062
R2-R4 = discr_lib:R?: Rezistorius; DIFF: 1%; PACK_TYPE: SMD; VENT_CODE: ZELRS019
R5 = discr_lib:R?: Rezistorius; DIFF: 1%; PACK_TYPE: SMD; VENT_CODE: ZELRS053
R6 = discr_lib:R?: Rezistorius; DIFF: 1%; PACK_TYPE: SMD; VENT_CODE: ZELRS062
R7 = rcl:R-US_: Rezistorius; PACK_TYPE: SMD
R31 = discr_lib:R?: Rezistorius; DIFF: 1%; PACK_TYPE: SMD; VENT_CODE: ZELRS061
TP2 = testpad:TP: Test pad

## Module M4
Ports: GND(pwr) INA(in) INB(in) INC(in) IND(in) INE(in) INF(in) ING(in) INH(in) VDD(pwr) LAT(in) SCK(in) MISO(out) MOSI(in)
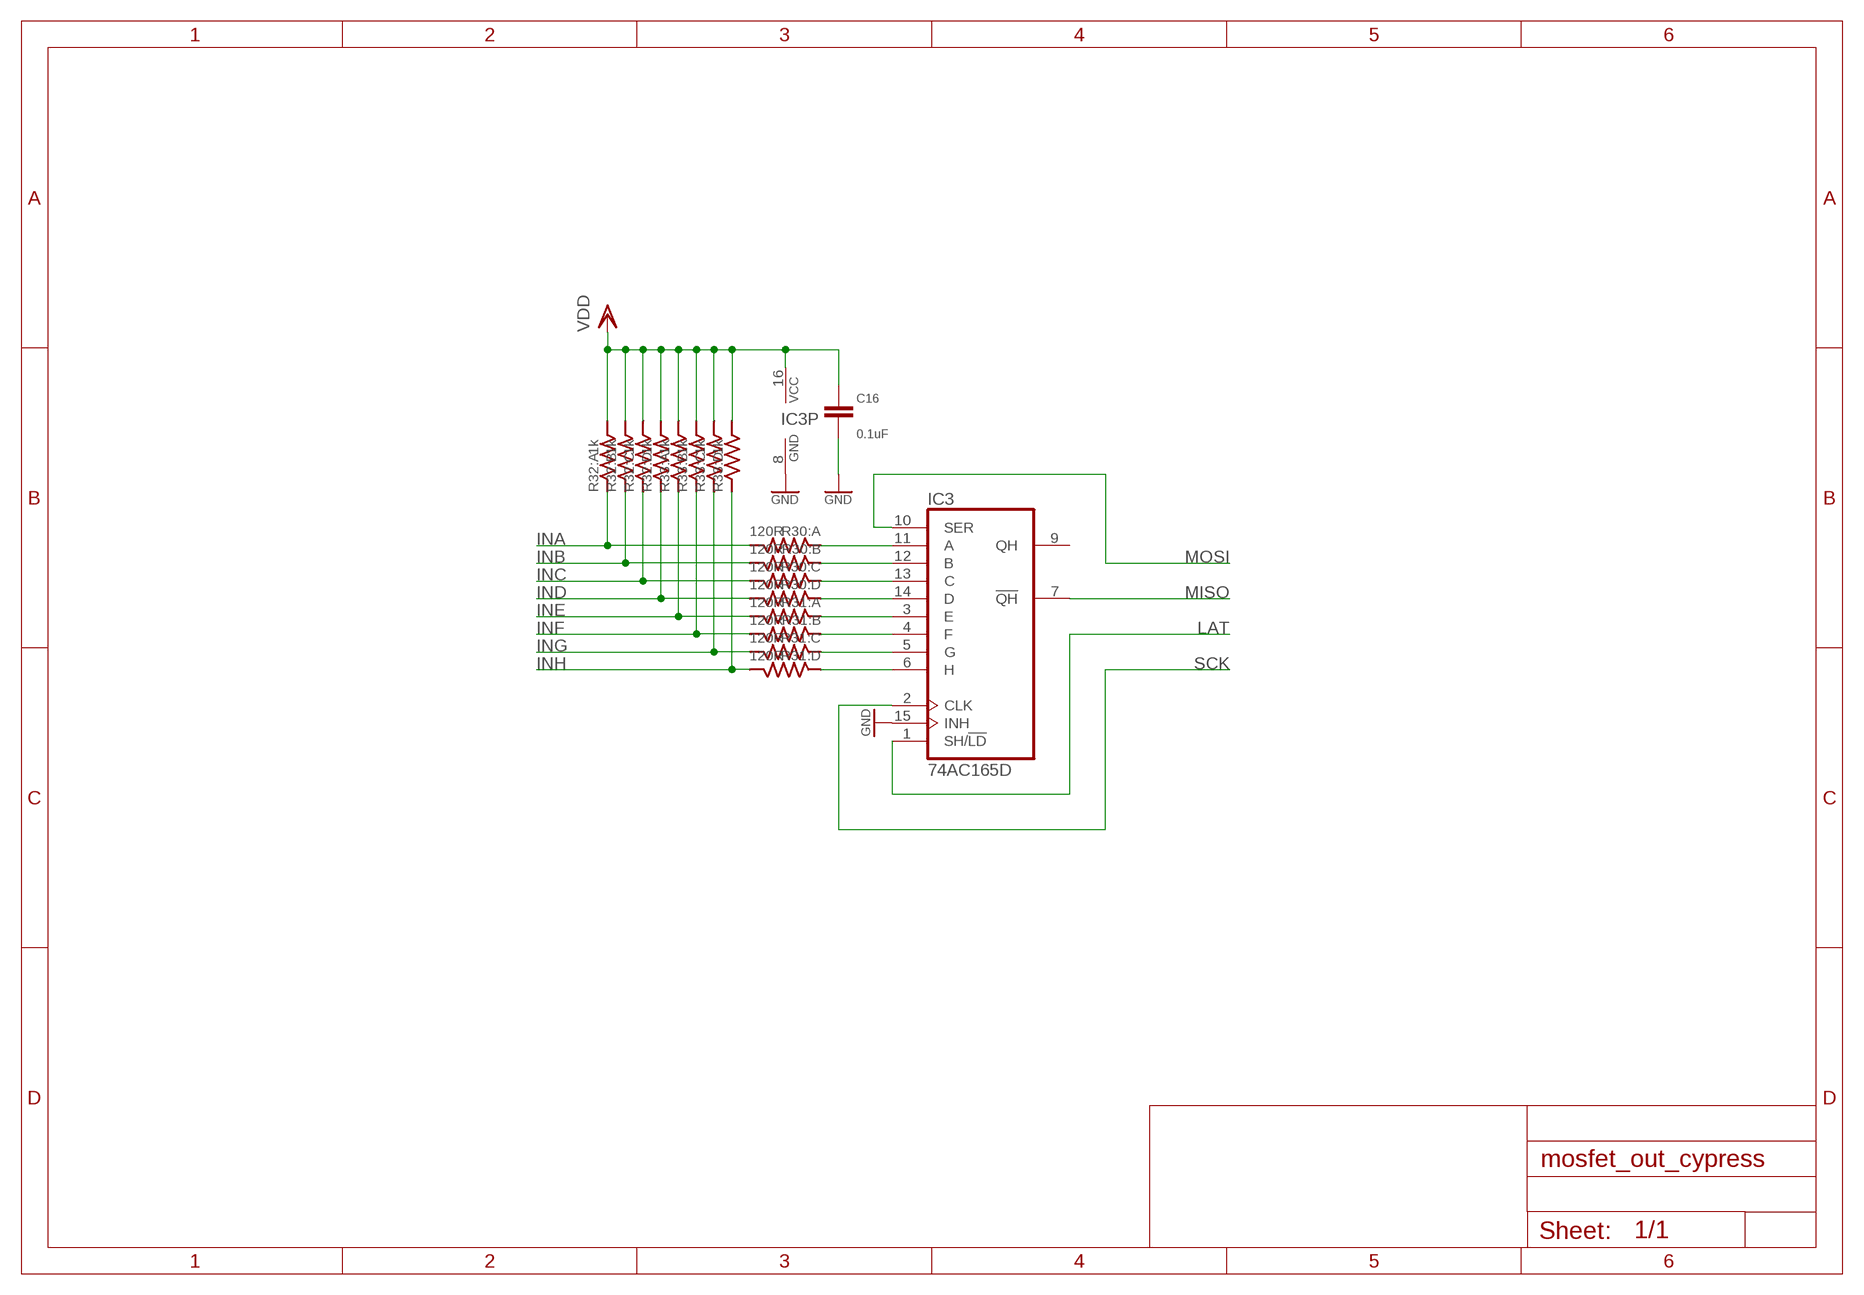
[diagram p4: schematic, module M4, sheet 1]

### Parts
C16  0.1uF  C0805-0.1UF  [C0805]
IC3  74AC165D  [SO16]
R30  120R  CTS742C083  [CTS742C083]
R31  120R  CTS742C083  [CTS742C083]
R32  1k  CTS742C083  [CTS742C083]
R33  1k  CTS742C083  [CTS742C083]

### Nets
GND: C16.2 IC3.8(GND) IC3.15(INH)
INA: R30.1B R32.1A
INB: R30.2B R32.2A
INC: R30.3B R32.3A
IND: R30.4B R32.4A
INE: R31.1B R33.1A
INF: R31.2B R33.2A
ING: R31.3B R33.3A
INH: R31.4B R33.4A
LAT: IC3.1(SH/!LD)
MISO: IC3.7(!QH)
MOSI: IC3.10(SER)
N$1: IC3.6(H) R31.4A
N$2: IC3.5(G) R31.3A
N$3: IC3.4(F) R31.2A
N$4: IC3.3(E) R31.1A
N$5: IC3.11(A) R30.1A
N$6: IC3.12(B) R30.2A
N$7: IC3.13(C) R30.3A
N$8: IC3.14(D) R30.4A
SCK: IC3.2(CLK)
VDD [power]: C16.1 IC3.16(VCC) R32.1B R32.2B R32.3B R32.4B R33.1B R33.2B R33.3B R33.4B
Unconnected: IC3.9(QH)

### Library data of the parts
C16 = discr_lib:C?: Kondensatorius; PACK_TYPE: SMD; TYPE: X7R; VENT_CODE: ZKN065
IC3 = 74xx-eu:74*165: 8-bit parallel load SHIFT REGISTER
R30-R33 = descreet:CTS742C083

## Module M5
Ports: TX(in) DE(in) RX(out) RSA(io) RSB(io) GND(pwr) VDD(pwr) PE(pwr) TERM(io)
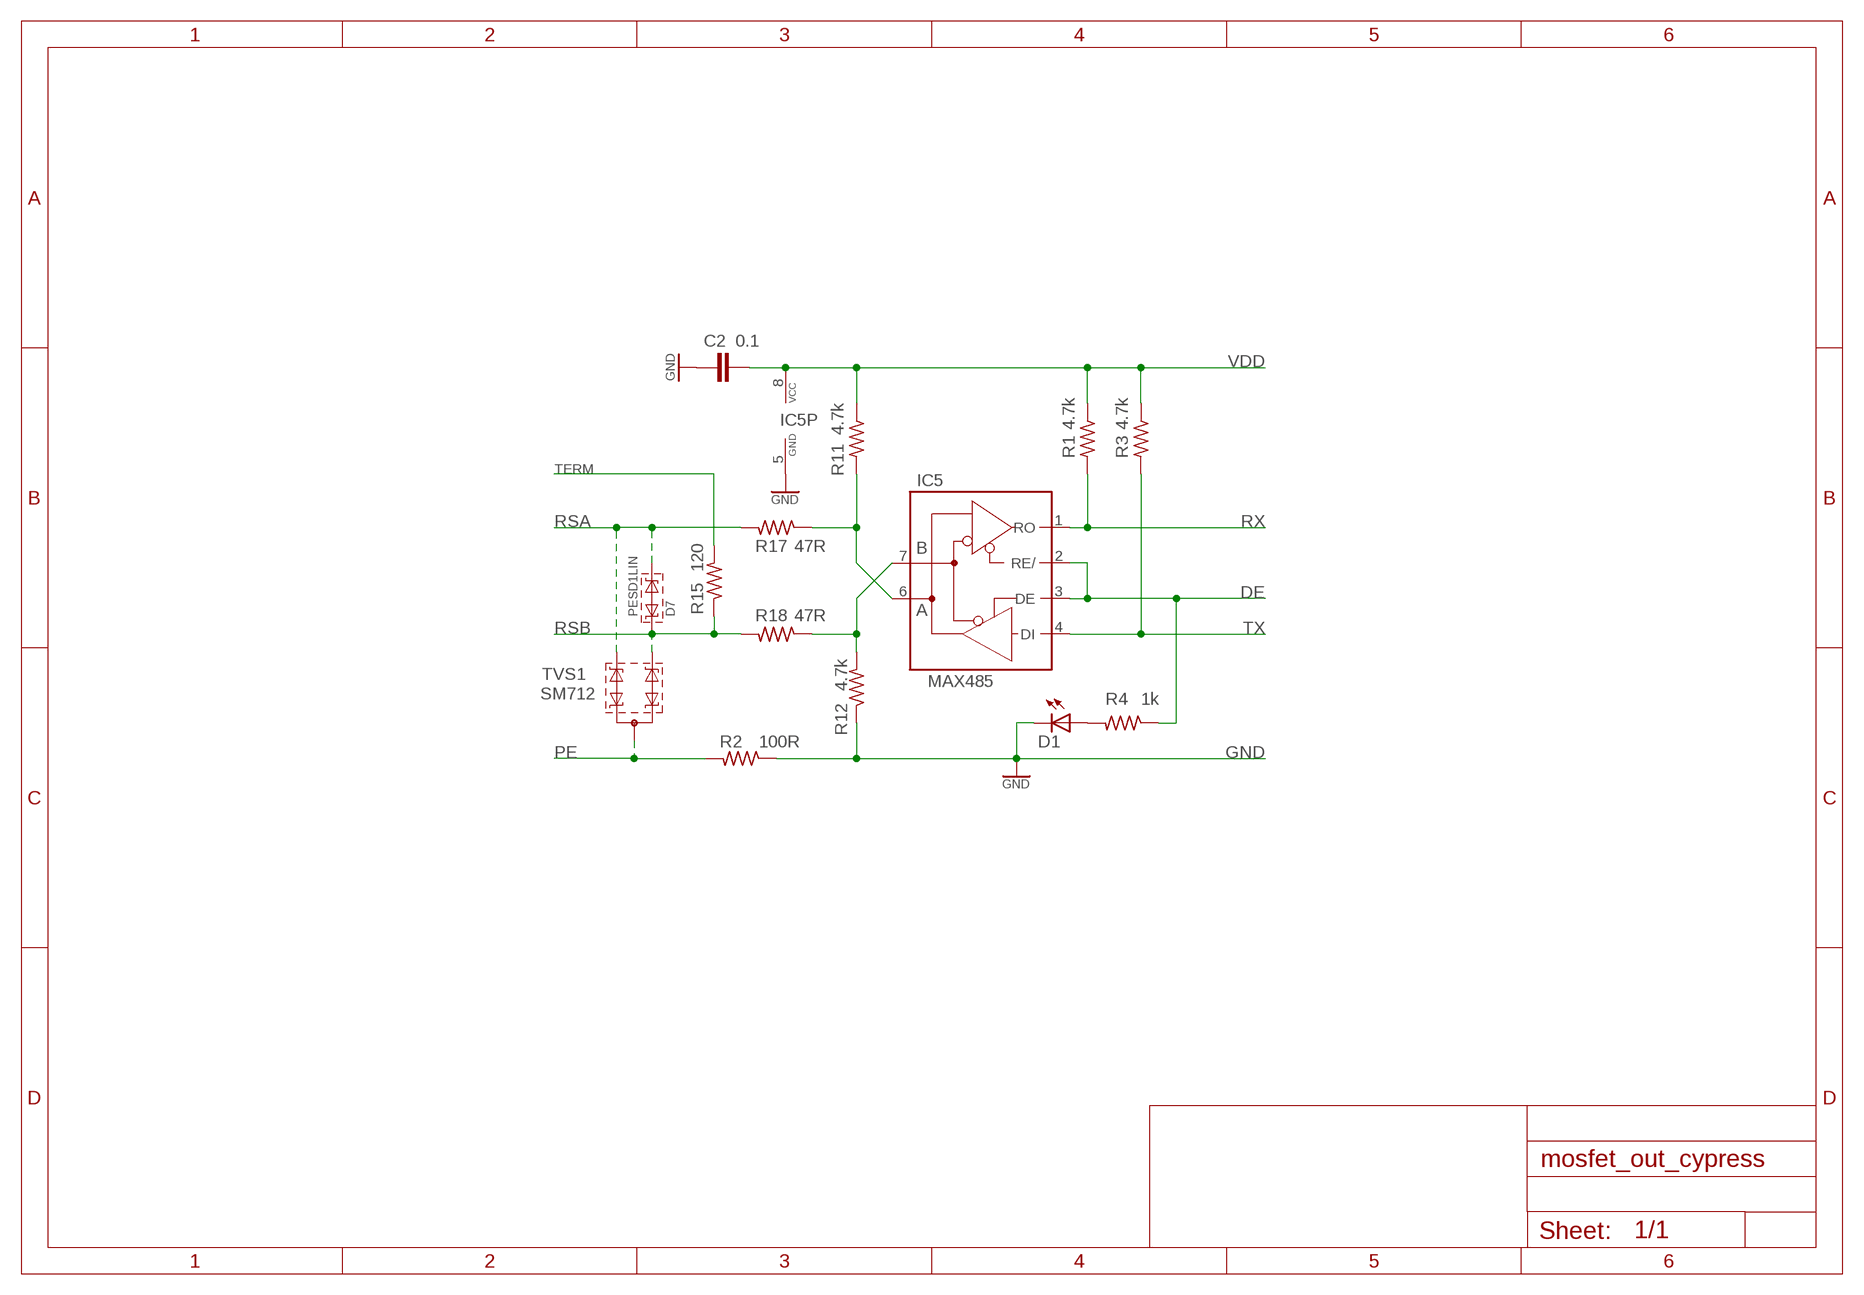
[diagram p5: schematic, module M5, sheet 1]

### Parts
C2  0.1  C-EUC0805  [C0805]
D1  EL19-21SYGC  LED-EL19-21SYGC-0805  [CHIPLED_0805]
D7  PESD1LIN  PESD5V0U1BA-R  [SOD323-R]
IC5  MAX485  MAX485CSA  [ESOP-8]
R1  4.7k  R-US_R0805  [R0805]
R2  100R  R-US_R1210  [R1210]
R3  4.7k  R-US_R0805  [R0805]
R4  1k  R0805-1K-1%  [R0805]
R11  4.7k  R-US_R0805  [R0805]
R12  4.7k  R-US_R0805  [R0805]
R15  120  R-US_R0805  [R0805]
R17  47R  R-US_R0805  [R0805]
R18  47R  R-US_R0805  [R0805]
TVS1  SM712  [SOT23]

### Nets
DE: IC5.2(RE/) IC5.3(DE) R4.1
GND: C2.2 D1.C IC5.5(GND) R2.1 R12.1
N$2: IC5.7(B) R12.2 R18.1
N$3: IC5.6(A) R11.2 R17.1
N$4: D1.A R4.2
PE: R2.2 TVS1.3
RSA: D7.C(C2) R17.2 TVS1.2
RSB: D7.A(C1) R15.1 R18.2 TVS1.1
RX: IC5.1(RO) R1.2
TERM: R15.2
TX: IC5.4(DI) R3.2
VDD [power]: C2.1 IC5.8(VCC) R1.1 R3.1 R11.1

### Library data of the parts
C2 = rcl:C-EU: Kondensatorius
D1 = discr_lib:LED*: Sviesos diodas; PACK_TYPE: SMD; PARAMS: Green; VENT_CODE: ZELD010
D7 = repeater:PESD5V0U1BA
IC5 = linear:MAX48*?: RS485 TRANSEIVER; VENT_CODE: ZELM048
R1 R3 R11 R12 R15 R17 R18 = rcl:R-US_: Rezistorius; PACK_TYPE: SMD
R2 = rcl:R-US_: Rezistorius
R4 = discr_lib:R?: Rezistorius; DIFF: 1%; PACK_TYPE: SMD; VENT_CODE: ZELRS061
TVS1 = repeater:SM712

## Module STM
Ports: GND(pwr)
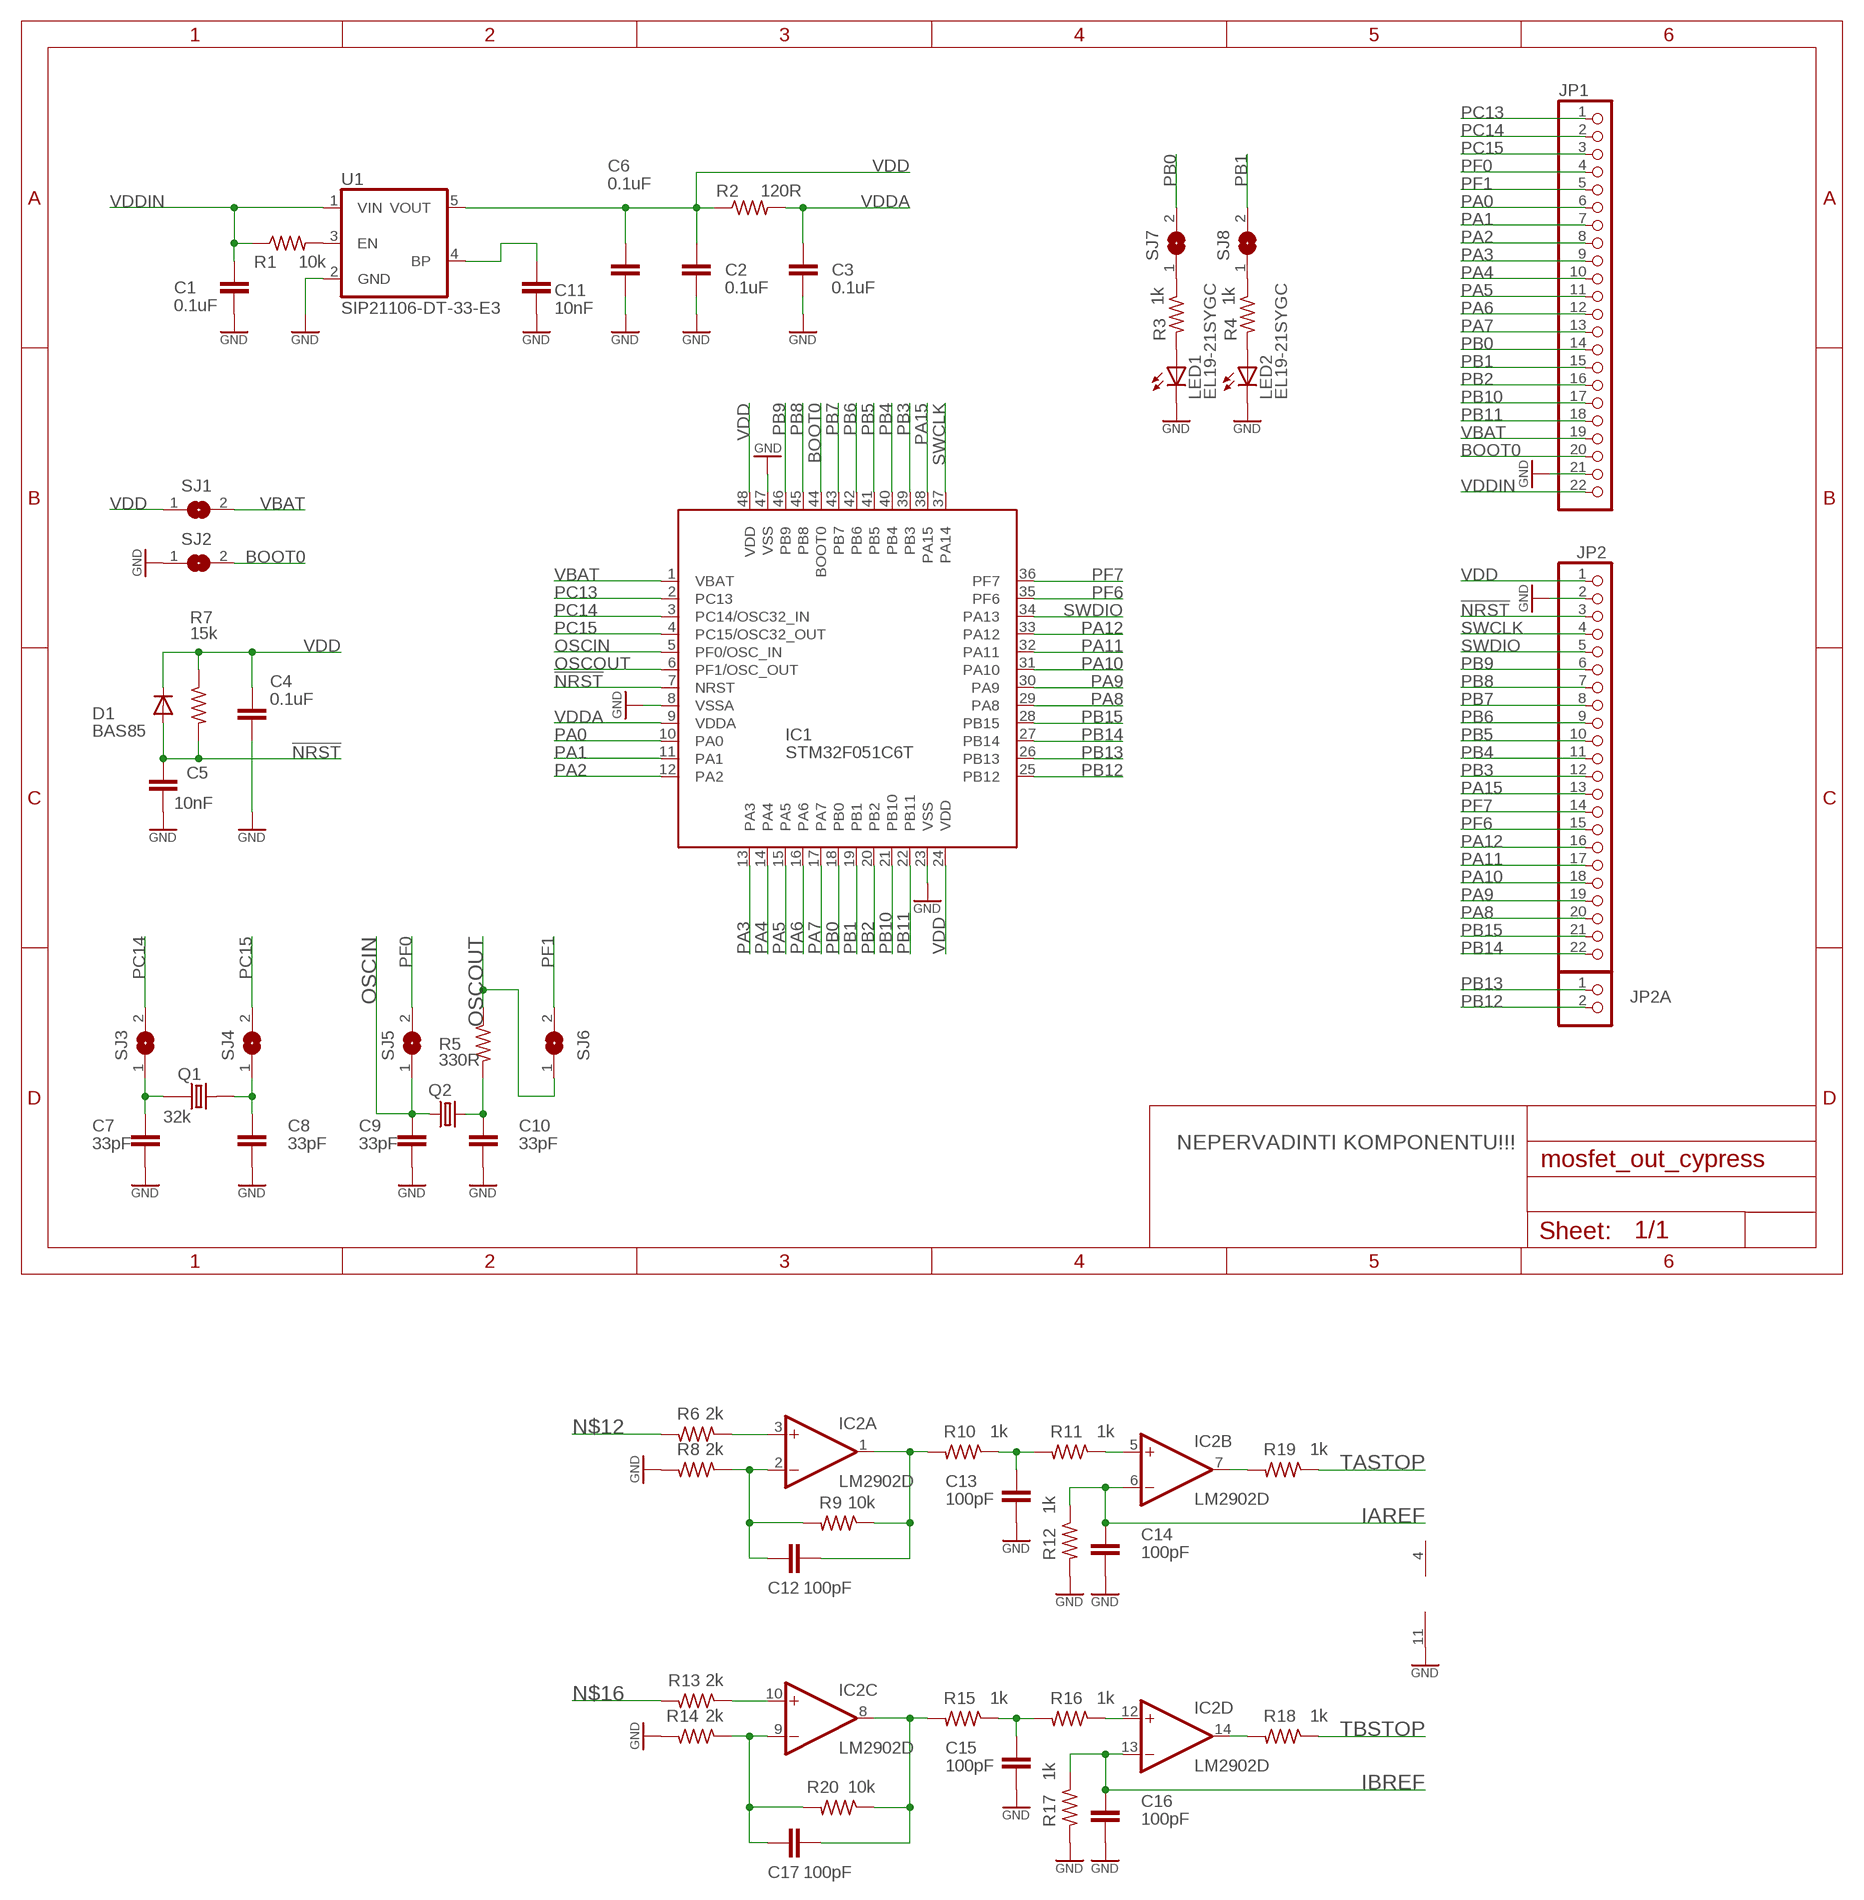
[diagram p6: schematic, module STM, sheet 1]

### Parts
C1  0.1uF  C0805-0.1UF  [C0805]
C2  0.1uF  C0805-0.1UF  [C0805]
C3  0.1uF  C0805-0.1UF  [C0805]
C4  0.1uF  C0805-0.1UF  [C0805]
C5  10nF  C0805-10NF  [C0805]
C6  0.1uF  C0805-0.1UF  [C0805]
C7  33pF  C0805-33PF  [C0805]
C8  33pF  C0805-33PF  [C0805]
C9  33pF  C0805-33PF  [C0805]
C10  33pF  C0805-33PF  [C0805]
C11  10nF  C0805-10NF  [C0805]
C12  100pF  C0805-100PF  [C0805]
C13  100pF  C0805-100PF  [C0805]
C14  100pF  C0805-100PF  [C0805]
C15  100pF  C0805-100PF  [C0805]
C16  100pF  C0805-100PF  [C0805]
C17  100pF  C0805-100PF  [C0805]
D1  BAS85  DIODE-MINIMELF  [MINIMELF]
IC1  STM32F051C6T  [TQFP48]
IC2  LM2902D  [SO14]
JP1  PINHD-1X22  [1X22]
JP2  PINHD-1X22  [1X22]
JP2A  PINHD-1X2  [1X02]
LED1  EL19-21SYGC  LED-EL19-21SYGC-0805  [CHIPLED_0805]
LED2  EL19-21SYGC  LED-EL19-21SYGC-0805  [CHIPLED_0805]
Q1  32k  Q2  [TC38H]
Q2  CRYSTALSM49  [SM49]
R1  10k  R0805-10K-1%  [R0805]
R2  120R  R0805-120R-1%  [R0805]
R3  1k  R0805-1K-1%  [R0805]
R4  1k  R0805-1K-1%  [R0805]
R5  330R  R0805-330R-1%  [R0805]
R6  2k  R0805-2K-1%  [R0805]
R7  15k  R0805-15K-1%  [R0805]
R8  2k  R0805-2K-1%  [R0805]
R9  10k  R0805-10K-1%  [R0805]
R10  1k  R0805-1K-1%  [R0805]
R11  1k  R0805-1K-1%  [R0805]
R12  1k  R0805-1K-1%  [R0805]
R13  2k  R0805-2K-1%  [R0805]
R14  2k  R0805-2K-1%  [R0805]
R15  1k  R0805-1K-1%  [R0805]
R16  1k  R0805-1K-1%  [R0805]
R17  1k  R0805-1K-1%  [R0805]
R18  1k  R0805-1K-1%  [R0805]
R19  1k  R0805-1K-1%  [R0805]
R20  10k  R0805-10K-1%  [R0805]
SJ1  SJA  [SJA]
SJ2  SJA  [SJA]
SJ3  SJA  [SJA]
SJ4  SJA  [SJA]
SJ5  SJA  [SJA]
SJ6  SJA  [SJA]
SJ7  SJA  [SJA]
SJ8  SJA  [SJA]
U1  SIP21106-DT-33-E3  SIP21106DT  [SOT25]

### Nets
!NRST: C5.1 D1.A IC1.7(NRST) JP2.3 R7.2
BOOT0: IC1.44(BOOT0) JP1.20 SJ2.2
GND: C1.2 C2.2 C3.2 C4.2 C5.2 C6.2 C7.2 C8.2 C9.2 C10.2 C11.2 C13.2 C14.2 C15.2 C16.2 IC1.8(VSSA) IC1.23(VSS) IC1.47(VSS) IC2.11(P:V-) JP1.21 JP2.2 LED1.C LED2.C R8.2 R12.2 R14.2 R17.2 SJ2.1 U1.2(GND)
IAREF: C14.1 IC2.6(B:-IN) R12.1
IBREF: C16.1 IC2.13(D:-IN) R17.1
N$1: C7.1 Q1.1 SJ3.1
N$2: C8.1 Q1.2 SJ4.1
N$3: C10.1 Q2.2 R5.2
N$4: IC2.3(A:+IN) R6.1
N$5: LED1.A R3.2
N$6: R3.1 SJ7.1
N$7: C11.1 U1.4(BP)
N$8: R1.2 U1.3(EN)
N$9: LED2.A R4.2
N$10: R4.1 SJ8.1
N$11: C12.1 IC2.2(A:-IN) R8.1 R9.2
N$12: R6.2
N$13: C12.2 IC2.1(A:OUT) R9.1 R10.2
N$14: C13.1 R10.1 R11.2
N$15: IC2.5(B:+IN) R11.1
N$16: R13.2
N$17: IC2.10(C:+IN) R13.1
N$18: C17.2 IC2.8(C:OUT) R15.2 R20.1
N$19: C15.1 R15.1 R16.2
N$20: IC2.12(D:+IN) R16.1
N$21: C17.1 IC2.9(C:-IN) R14.1 R20.2
N$23: IC2.7(B:OUT) R19.2
N$24: IC2.14(D:OUT) R18.2
OSCIN: C9.1 IC1.5(PF0/OSC_IN) Q2.1 SJ5.1
OSCOUT: IC1.6(PF1/OSC_OUT) R5.1 SJ6.1
PA0: IC1.10(PA0) JP1.6
PA1: IC1.11(PA1) JP1.7
PA2: IC1.12(PA2) JP1.8
PA3: IC1.13(PA3) JP1.9
PA4: IC1.14(PA4) JP1.10
PA5: IC1.15(PA5) JP1.11
PA6: IC1.16(PA6) JP1.12
PA7: IC1.17(PA7) JP1.13
PA8: IC1.29(PA8) JP2.20
PA9: IC1.30(PA9) JP2.19
PA10: IC1.31(PA10) JP2.18
PA11: IC1.32(PA11) JP2.17
PA12: IC1.33(PA12) JP2.16
PA15: IC1.38(PA15) JP2.13
PB0: IC1.18(PB0) JP1.14 SJ7.2
PB1: IC1.19(PB1) JP1.15 SJ8.2
PB2: IC1.20(PB2) JP1.16
PB3: IC1.39(PB3) JP2.12
PB4: IC1.40(PB4) JP2.11
PB5: IC1.41(PB5) JP2.10
PB6: IC1.42(PB6) JP2.9
PB7: IC1.43(PB7) JP2.8
PB8: IC1.45(PB8) JP2.7
PB9: IC1.46(PB9) JP2.6
PB10: IC1.21(PB10) JP1.17
PB11: IC1.22(PB11) JP1.18
PB12: IC1.25(PB12) JP2A.2
PB13: IC1.26(PB13) JP2A.1
PB14: IC1.27(PB14) JP2.22
PB15: IC1.28(PB15) JP2.21
PC13: IC1.2(PC13) JP1.1
PC14: IC1.3(PC14/OSC32_IN) JP1.2 SJ3.2
PC15: IC1.4(PC15/OSC32_OUT) JP1.3 SJ4.2
PF0: JP1.4 SJ5.2
PF1: JP1.5 SJ6.2
PF6: IC1.35(PF6) JP2.15
PF7: IC1.36(PF7) JP2.14
SWCLK: IC1.37(PA14) JP2.4
SWDIO: IC1.34(PA13) JP2.5
TASTOP: R19.1
TBSTOP: R18.1
VBAT: IC1.1(VBAT) JP1.19 SJ1.2
VDD: C2.1 C4.1 C6.1 D1.C IC1.24(VDD) IC1.48(VDD) JP2.1 R2.1 R7.1 SJ1.1 U1.5(VOUT)
VDDA: C3.1 IC1.9(VDDA) R2.2
VDDIN: C1.1 JP1.22 R1.1 U1.1(VIN)

### Notes on the sheet
- NEPERVADINTI KOMPONENTU!!!

### Power pins joined to a net without a drawn wire
V+: IC2.4(P:V+)

### Library data of the parts
C1-C4 C6 = discr_lib:C?: Kondensatorius; PACK_TYPE: SMD; TYPE: X7R; VENT_CODE: ZKN065
C5 C11 = discr_lib:C?: Kondensatorius; PACK_TYPE: SMD; TYPE: X7R; U: 50V; VENT_CODE: ZKN080
C7-C10 = discr_lib:C?: Kondensatorius; PACK_TYPE: SMD; TYPE: X7R; U: 50V; VENT_CODE: ZKN023
C12-C17 = discr_lib:C?: Kondensatorius; PACK_TYPE: SMD; U: 50V; VENT_CODE: ---
D1 = diode:DIODE-: DIODE
IC1 = stm:STM32F051C*?; USER_CODE_SIZE: 32 Kb
IC2 = linear:LM2902: COMPARATOR
JP1 JP2 = pinhead:PINHD-1X22: PIN HEADER
JP2A = pinhead:PINHD-1X2: PIN HEADER
LED1 LED2 = discr_lib:LED*: Sviesos diodas; PACK_TYPE: SMD; PARAMS: Green; VENT_CODE: ZELD010
Q1 = descreet:Q2
Q2 = crystal:CRYSTAL: CRYSTAL
R1 R9 R20 = discr_lib:R?: Rezistorius; DIFF: 1%; PACK_TYPE: SMD; VENT_CODE: ---
R2 = discr_lib:R?: Rezistorius; DIFF: 1%; PACK_TYPE: SMD; VENT_CODE: ZELRS055
R3 R4 R10-R12 R15-R19 = discr_lib:R?: Rezistorius; DIFF: 1%; PACK_TYPE: SMD; VENT_CODE: ZELRS061
R5 = discr_lib:R?: Rezistorius; DIFF: 1%; PACK_TYPE: SMD; VENT_CODE: ZELRS018
R6 R8 R13 R14 = discr_lib:R?: Rezistorius; DIFF: 1%; PACK_TYPE: SMD; VENT_CODE: ZELRS063
R7 = discr_lib:R?: Rezistorius; DIFF: 1%; PACK_TYPE: SMD; VENT_CODE: ZELRS052
SJ1-SJ8 = jumper:SJ: SMD solder JUMPER
U1 = v-reg:SIP2110*?: Stabilizatorius; MARK: N3; PACK_TYPE: SMD; VENT_CODE: ZELM092

## Net classes
0 default: clearance 0.2 mm
1 power: clearance 0.305 mm to class 0, clearance 0.305 mm
2 power+: clearance 0.42 mm to class 0